# Altium schematic sheet STM.SchDoc
size A4; SheetNumber: 1
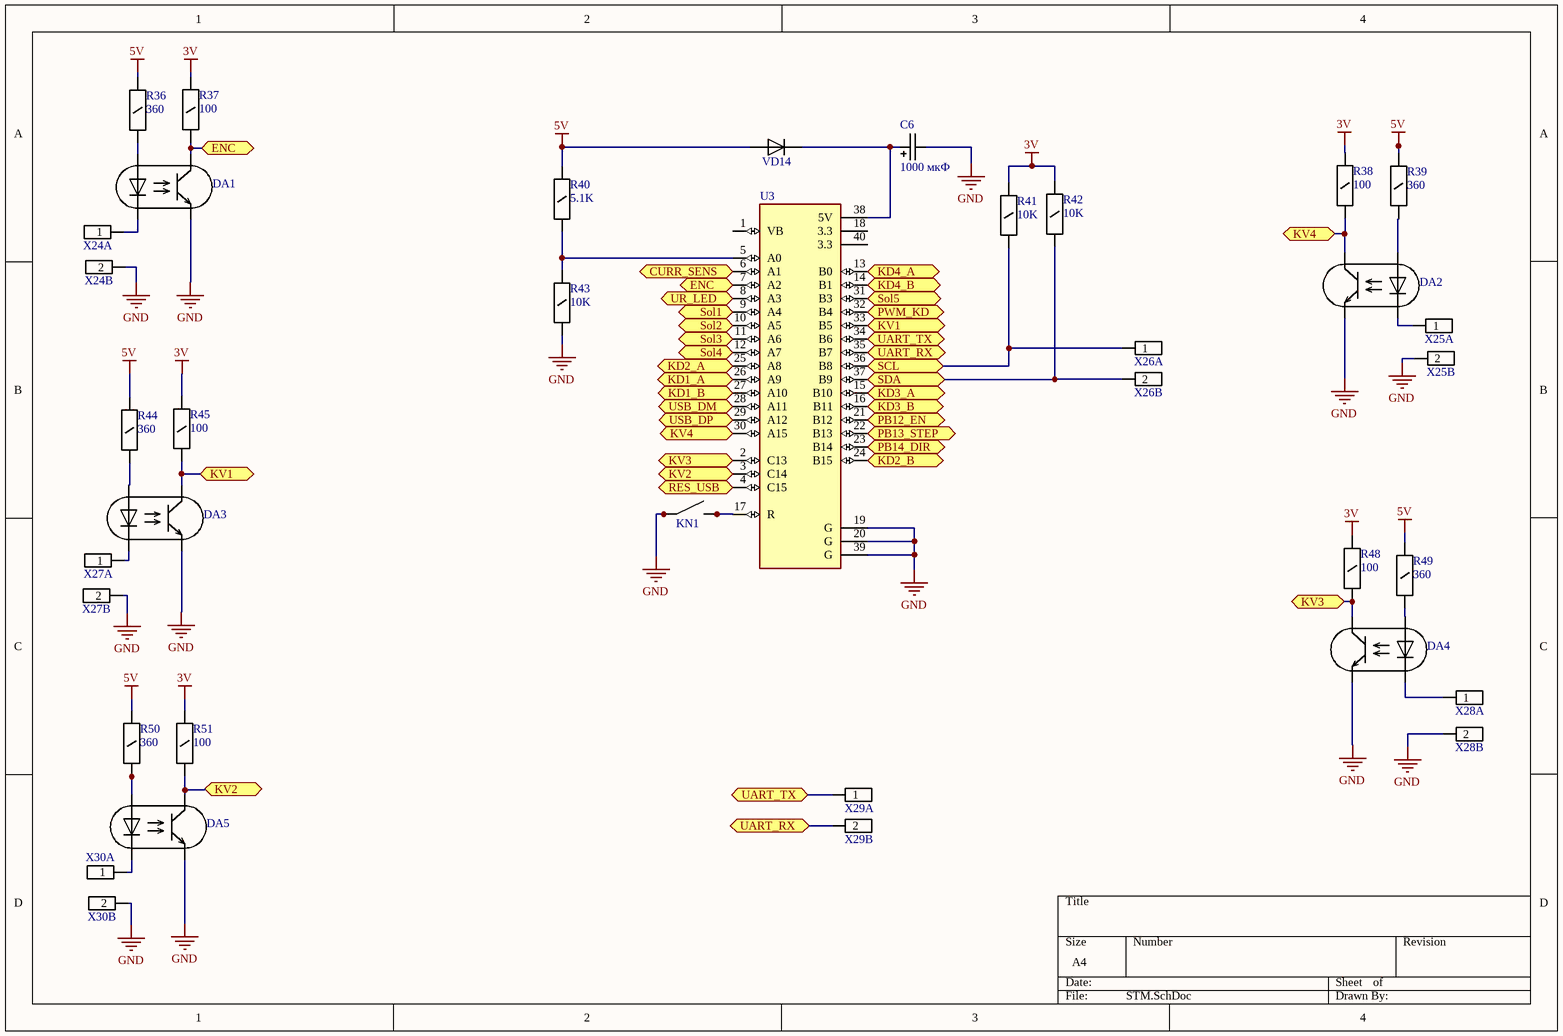
[diagram p0: STM.SchDoc]

## Parts
C6  1000 мкФ  [C_12.5x5]
DA1  PC817  [SOIC254P1000X400-4N]  (value not drawn)
DA2  PC817  [SOIC254P1000X400-4N]  (value not drawn)
DA3  PC817  [SOIC254P1000X400-4N]  (value not drawn)
DA4  PC817  [SOIC254P1000X400-4N]  (value not drawn)
DA5  PC817  [SOIC254P1000X400-4N]  (value not drawn)
KN1  TS-A2PG-130  [TS-A2PG-130]  (value not drawn)
R36  360  [R_1206]
R37  100  [R_1206]
R38  100  [R_1206]
R39  360  [R_1206]
R40  5.1K  [R_1206]
R41  10K  [R_1206]
R42  10K  [R_1206]
R43  10K  [R_1206]
R44  360  [R_1206]
R45  100  [R_1206]
R48  100  [R_1206]
R49  360  [R_1206]
R50  360  [R_1206]
R51  100  [R_1206]
U3  STM32F103-BluePill  [MODULE_ZC323000]  (value not drawn)
VD14  1N4148W  [SOD-123]  (value not drawn)
X24  DG508V-02  [DG508V-02]  (value not drawn)  (parts A,B of 2)
X25  DG508V-02  [DG508V-02]  (value not drawn)  (parts A,B of 2)
X26  DG508V-02  [DG508V-02]  (value not drawn)  (parts A,B of 2)
X27  DG508V-02  [DG508V-02]  (value not drawn)  (parts A,B of 2)
X28  DG508V-02  [DG508V-02]  (value not drawn)  (parts A,B of 2)
X29  DG508V-02  [DG508V-02]  (value not drawn)  (parts A,B of 2)
X30  DG508V-02  [DG508V-02]  (value not drawn)  (parts A,B of 2)

## Ports
CURR_SENS, ENC, KD1_A, KD1_B, KD2_A, KD2_B, KD3_A, KD3_B, KD4_A, KD4_B, KV1, KV2, KV3, KV4, PB12_EN, PB13_STEP, PB14_DIR, PWM_KD, RES_USB, SCL, SDA, Sol1, Sol2, Sol3, Sol4, Sol5, UART_RX, UART_TX, UR_LED, USB_DM, USB_DP

## Nets
3V: R37.1 R38.1 R41.1 R42.1 R45.1 R48.1 R51.1
5V: R36.1 R39.1 R40.1 R44.1 R49.1 R50.1 VD14.A
GND: C6.2 DA1.3 DA2.3 DA3.3 DA4.3 DA5.3 KN1.1 KN1.2 R43.1 U3.19(G) U3.20(G) U3.39(G) X24.2 X25.2 X27.2 X28.2 X30.2
CURR_SENS: U3.6(A1) ; port CURR_SENS
ENC: DA1.4 R37.2 U3.7(A2) ; port ENC
KD1_A: U3.26(A9) ; port KD1_A
KD1_B: U3.27(A10) ; port KD1_B
KD2_A: U3.25(A8) ; port KD2_A
KD2_B: U3.24(B15) ; port KD2_B
KD3_A: U3.15(B10) ; port KD3_A
KD3_B: U3.16(B11) ; port KD3_B
KD4_A: U3.13(B0) ; port KD4_A
KD4_B: U3.14(B1) ; port KD4_B
KV1: DA3.4 R45.2 U3.33(B5) ; port KV1
KV2: DA5.4 R51.2 U3.3(C14) ; port KV2
KV3: DA4.4 R48.2 U3.2(C13) ; port KV3
KV4: DA2.4 R38.2 U3.30(A15) ; port KV4
PB12_EN: U3.21(B12) ; port PB12_EN
PB13_STEP: U3.22(B13) ; port PB13_STEP
PB14_DIR: U3.23(B14) ; port PB14_DIR
PWM_KD: U3.32(B4) ; port PWM_KD
RES_USB: U3.4(C15) ; port RES_USB
SCL: R41.2 U3.36(B8) X26.1 ; port SCL
SDA: R42.2 U3.37(B9) X26.2 ; port SDA
Sol1: U3.9(A4) ; port Sol1
Sol2: U3.10(A5) ; port Sol2
Sol3: U3.11(A6) ; port Sol3
Sol4: U3.12(A7) ; port Sol4
Sol5: U3.31(B3) ; port Sol5
UART_RX: U3.35(B7) X29.2 ; port UART_RX
UART_TX: U3.34(B6) X29.1 ; port UART_TX
UR_LED: U3.8(A3) ; port UR_LED
USB_DM: U3.28(A11) ; port USB_DM
USB_DP: U3.29(A12) ; port USB_DP
NetC6_1: C6.1 U3.38(5V) VD14.K
NetDA1_1: DA1.1 R36.2
NetDA1_2: DA1.2 X24.1
NetDA2_1: DA2.1 R39.2
NetDA2_2: DA2.2 X25.1
NetDA3_1: DA3.1 R44.2
NetDA3_2: DA3.2 X27.1
NetDA4_1: DA4.1 R49.2
NetDA4_2: DA4.2 X28.1
NetDA5_1: DA5.1 R50.2
NetDA5_2: DA5.2 X30.1
NetKN1_3: KN1.3 KN1.4 U3.17(R)
NetR40_2: R40.2 R43.2 U3.5(A0)

Not connected (* = marked no-connect by the designer): U3 1(VB) 18(3.3) 40(3.3)

## Library data of the parts
C6 = Конденсатор 16х7.5: К50-35; Tolerance: 20%; Type: Электролитический конденсатор; Life: 2000 часов; Name: К50-35; Value: 1000 мкФ; Mounting: в отверстие
DA1-DA5 = KPC357NT: оптрон, SMD; Name: PC817; Mounting: SMD
KN1 = TS-A2PG-130 (5-й вывод): Кнопка 5 мм; Name: TS-A2PG-130; Height: 5 mm
R36-R45 R48-R51 = Резистор 1206: 0,25 Вт; Name: 1206; Power: 0.25 Вт; Tolerance: 5%; Voltage: 200В; Type: Резистор ЧИП; Mounting: SMD
  R36 R39 R44 R49 R50: Value: 360
  R37 R38 R45 R48 R51: Value: 100
  R40: Value: 5.1K
  R41-R43: Value: 10K
U3 = ZC323000: STM32F103C8T6 ARM STM32 Minimum System Development Board Module For Arduino; MF: YKS; Package: None; Availability: Unavailable; MP: STM32F103-BluePill; SnapEDA_Link: https://www.snapeda.com/parts/ZC323000/YKS/view-part/725364/?ref=snap; Value: *; Price: None
VD14 = 1N4148W: диод, SMD; Max current: 150 mA; Drop voltage: 1.25 В; Max voltage: 100 В; Power: 410 мВт; Name: 1N4148W; Mounting: SMD; Temperature: -65 .. +150
X24-X30 = DG508V-02: клеммник винтовой 2к.,5.08мм; Analog: MKDS 2/3; Name: DG508V-02; Type: шаг 5,08 мм; Mounting: в отверстие